# EAGLE design PCB-CARR-SL45 (EAGLE 7.5.0)
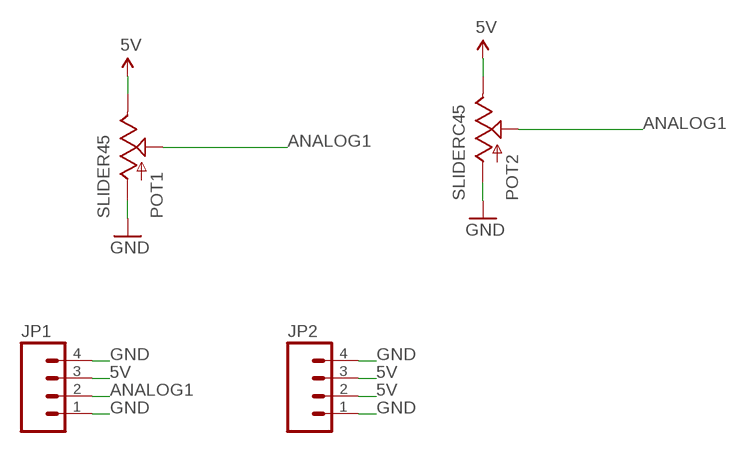
[diagram p0: schematic, sheet 1]

## Parts
JP1  M04PTH  [1X04]
JP2  M04PTH  [1X04]
POT1  SLIDER45  [SLIDER45]
POT2  SLIDERC45  [SLIDER45-CAR1]

## Nets
5V [Power]: JP1.3 JP2.2 JP2.3 POT1.1(E) POT2.1(E)
ANALOG1: JP1.2 POT1.2A(S) POT2.2A(S)
GND [Power]: JP1.1 JP1.4 JP2.1 JP2.4 POT1.3(A) POT2.3(A)

## Library data of the parts
JP1 JP2 = SparkFun:M04: Header 4 Standard 4-pin 0.1" header. Use with straight break away headers (SKU : PRT-00116), right angle break away headers (PRT-00553), swiss pins (PRT-00743), machine pins (PRT-00117), and female headers (PRT-00115). Molex polarized connector foot print use with SKU : PRT-08231 with associated crimp pins and housings. 1MM SMD Version SKU: PRT-10208
POT1 POT2 = SKAARHOJ:SLIDER

## Net classes
0 default: width 0.203 mm, drill 0.406 mm, clearance 0.152 mm
1 Power: width 0.406 mm, drill 0.61 mm, clearance 0.203 mm
2 Signal: width 0.152 mm, clearance 0.152 mm

## Board
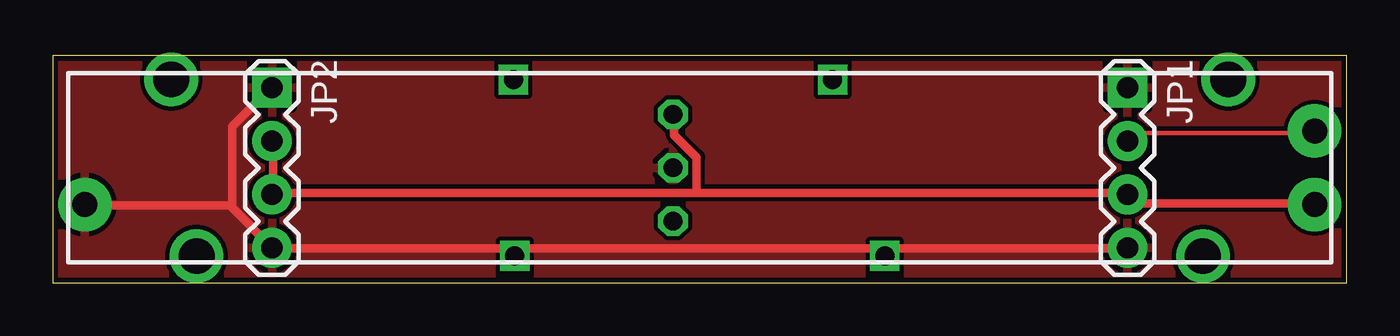
[diagram p1: board, top side]
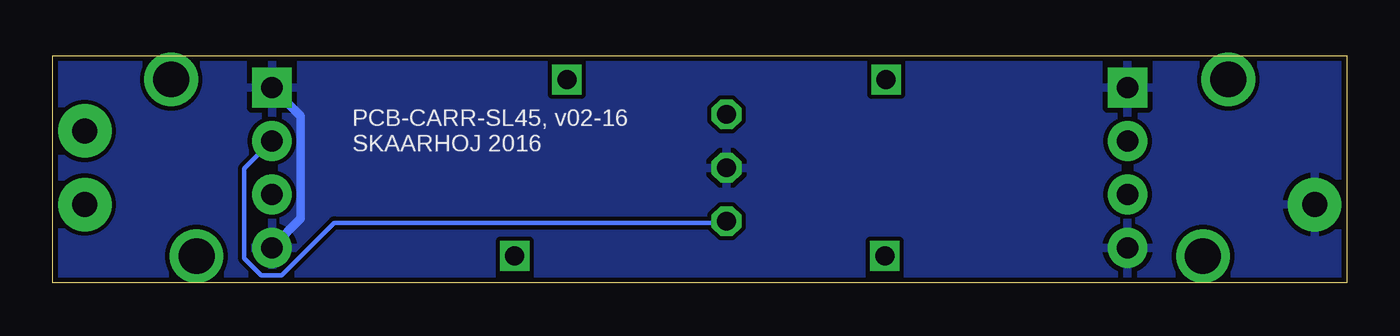
[diagram p2: board, bottom side, seen from below]

Size 61.47 x 10.79 mm. Coordinates in mm from the lower left corner, seen from the top.
Outline: 0,0 61.47,0 61.47,10.79 0,10.79 0,0
Copper layers (1*16): Top 0.035mm / dielectric 1.5mm / Bottom 0.035mm
Design rules "Fusion_eagle_rule_v1.1": minimum track width 6mil, minimum drill 12mil, track to track 6mil, track to pad 6mil, pad to pad 6mil, via to via 6mil, smd to smd 0mil, copper to edge 10mil, drill to drill 10mil, minimum pad ring 10mil, minimum via ring 6mil, stop-mask expansion 2mil, vias tented up to drill 100mil, thermal gap 10mil

### Footprints (pad centres in the part's own frame; a part is rotated, then mirrored left to right if it is on the bottom)
1X04 = drill 1.016 pad 1.88 square: 1 0,0 | drill 1.016 pad 1.88: 2 2.54,0; 3 5.08,0; 4 7.62,0
SLIDER45 = drill 1.194 pad 2.54: 1 -29.21,1.75; 2A -29.21,-1.75; 3 29.21,1.75 | drill 1.702: P$1 -23.9,4.2; P$2 23.9,4.2; P$3 25.1,-4.2; P$4 -25.1,-4.2
SLIDER45-CAR1 = drill 0.9 octagon: 1 -1.27,2.54; 2A -1.27,-2.54; 3 -1.27,0 | drill 0.9 square: P$1 -8.852,4.191; P$2 6.312,4.191; P$3 8.788,-4.191; P$4 -8.788,-4.191

### Placement (x,y rotation side)
JP1  51.05,9.27 270 top
JP2  10.41,9.27 270 top
POT1  30.73,5.46 180 top
POT2  30.73,5.46 0 top

### Tracks (layer width: path | path; a pad name or v marks a point on that pad's centre or on a via)
5V
  Top 0.406: JP2.2 10.46,6.71 10.46,4.27 JP2.3 10.67,4.27 30.58,4.27 | POT1.1 59.94,3.76 51.51,3.76 51.1,4.17 JP1.3 50.9,4.27 30.58,4.27 | 30.58,4.27 30.58,5.96 29.52,7.02 29.52,8 POT2.1
ANALOG1
  Top 0.203: JP1.2 51.1,6.81 51.41,7.11 59.94,7.11 POT1.2A
  Bottom 0.203: JP1.2 52.36,5.42 52.36,1.16 51.56,0.36 50.58,0.36 48.09,2.85 29.52,2.85 POT2.2A
GND
  Top 0.406: 8.43,3.66 10.36,1.73 JP2.4 10.57,1.63 51,1.63 JP1.4 | 8.43,3.66 1.52,3.66 POT1.3 | JP2.1 10.36,9.25 8.53,7.42 8.53,3.76 8.43,3.66
  Bottom 0.406: JP1.4 51,1.73 49.68,3.05 49.68,7.92 51,9.25 JP1.1
  pour Top: 0,0 62.23,0 62.23,11.43 0,11.43
  pour Bottom: 0,0 62.23,0 62.23,11.43 0,11.43

### Text on the board
_bsilk: PCB-CARR-SL45, v02-16 / SKAARHOJ 2016